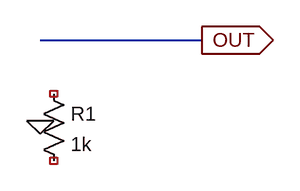
[diagram p0: schematic data_flags.asc]
data_flags.asc, the LTspice schematic file:
Version 4
SHEET 1 880 680
WIRE 96 96 288 96
FLAG 288 96 OUT
IOPIN 288 96 Out
FLAG 96 192 0
DATAFLAG 192 96 ""
DATAFLAG 240 96 "$*2"
SYMBOL res 96 144 R0
SYMATTR InstName R1
SYMATTR Value 1k

The netlist it stands for:
* data_flags.asc
R1 NC_01 NC_02 1k
.backanno
.end